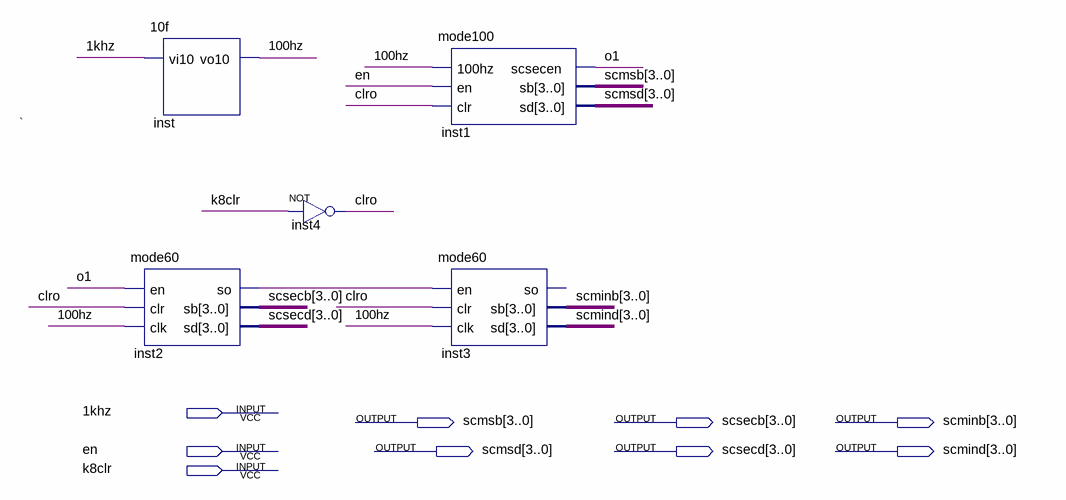
[diagram p0: schematic sheet]
// Quartus schematic miaobiao.bdf as structural Verilog: 5 symbols, 9 pins
module miaobiao (
  input  \1khz ,
  input  en,
  input  k8clr,
  output [3:0] scmsb,
  output [3:0] scsecb,
  output [3:0] scminb,
  output [3:0] scmsd,
  output [3:0] scsecd,
  output [3:0] scmind
);

  wire \100hz , clro, inst2_so, o1;

  \10f  inst (.vi10(\1khz ), .vo10(\100hz ));
  mode60 inst2 (.en(o1), .clr(clro), .clk(\100hz ), .so(inst2_so), .sb(scsecb), .sd(scsecd));
  not inst4 (clro, k8clr);
  mode100 inst1 (.\100hz (\100hz ), .en(en), .clr(clro), .scsecen(o1), .sb(scmsb), .sd(scmsd));
  mode60 inst3 (.en(inst2_so), .clr(clro), .clk(\100hz ), .sb(scminb), .sd(scmind));  // open: so

  // Notes on the sheet:
  //   `
endmodule
